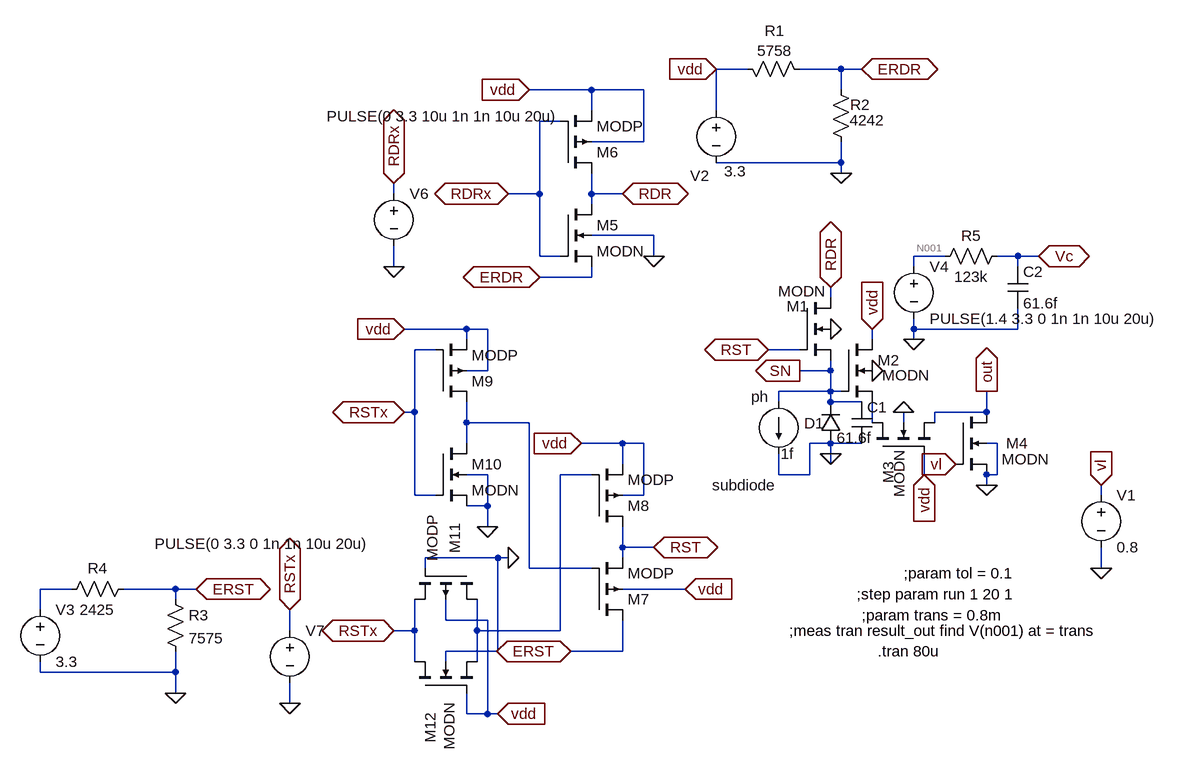
[diagram p0: schematic LIN LOG 2014 completo.asc]
LIN LOG 2014 completo.asc, the LTspice schematic file:
Version 4
SHEET 1 1672 840
WIRE 288 -4096 240 -4096
WIRE 432 -4096 368 -4096
WIRE 464 -4096 432 -4096
WIRE 48 -4064 -48 -4064
WIRE 128 -4064 48 -4064
WIRE 432 -4064 432 -4096
WIRE 48 -4032 48 -4064
WIRE 240 -4032 240 -4096
WIRE 0 -4016 -32 -4016
WIRE 128 -3984 128 -4064
WIRE 128 -3984 48 -3984
WIRE 432 -3952 432 -3984
WIRE 432 -3952 240 -3952
WIRE 432 -3936 432 -3952
WIRE -256 -3904 -256 -3920
WIRE -32 -3904 -32 -4016
WIRE -32 -3904 -80 -3904
WIRE 48 -3904 48 -3936
WIRE 96 -3904 48 -3904
WIRE 48 -3888 48 -3904
WIRE 144 -3840 48 -3840
WIRE -32 -3808 -32 -3904
WIRE 0 -3808 -32 -3808
WIRE 144 -3808 144 -3840
WIRE 592 -3808 544 -3808
WIRE 704 -3808 672 -3808
WIRE 736 -3808 704 -3808
WIRE -256 -3792 -256 -3824
WIRE 544 -3792 544 -3808
WIRE 704 -3792 704 -3808
WIRE 48 -3776 48 -3792
WIRE 48 -3776 -32 -3776
WIRE 416 -3744 416 -3760
WIRE -144 -3696 -240 -3696
WIRE -112 -3696 -144 -3696
WIRE 544 -3696 544 -3712
WIRE 704 -3696 704 -3728
WIRE 704 -3696 544 -3696
WIRE -144 -3680 -144 -3696
WIRE 480 -3680 480 -3696
WIRE 544 -3680 544 -3696
WIRE -192 -3664 -224 -3664
WIRE 368 -3664 320 -3664
WIRE -112 -3632 -112 -3696
WIRE -112 -3632 -144 -3632
WIRE 416 -3632 416 -3648
WIRE 416 -3632 368 -3632
WIRE 416 -3600 416 -3632
WIRE 416 -3600 336 -3600
WIRE 432 -3600 416 -3600
WIRE 336 -3584 336 -3600
WIRE 416 -3584 416 -3600
WIRE 464 -3584 416 -3584
WIRE -224 -3568 -224 -3664
WIRE -224 -3568 -240 -3568
WIRE 656 -3568 656 -3600
WIRE 656 -3568 576 -3568
WIRE -144 -3552 -144 -3584
WIRE -48 -3552 -144 -3552
WIRE 480 -3552 480 -3584
WIRE 528 -3552 528 -3568
WIRE 576 -3552 576 -3568
WIRE -144 -3520 -144 -3552
WIRE 96 -3520 32 -3520
WIRE 128 -3520 96 -3520
WIRE 416 -3520 384 -3520
WIRE 464 -3520 416 -3520
WIRE 672 -3520 656 -3520
WIRE 416 -3504 416 -3520
WIRE 96 -3488 96 -3520
WIRE 416 -3488 416 -3504
WIRE -112 -3472 -144 -3472
WIRE 48 -3472 0 -3472
WIRE 336 -3472 336 -3504
WIRE 384 -3472 384 -3520
WIRE 384 -3472 336 -3472
WIRE 560 -3472 560 -3504
WIRE 656 -3472 656 -3488
WIRE 672 -3472 672 -3520
WIRE 672 -3472 656 -3472
WIRE 656 -3456 656 -3472
WIRE -224 -3440 -224 -3568
WIRE -192 -3440 -224 -3440
WIRE 128 -3440 128 -3520
WIRE 128 -3440 96 -3440
WIRE 832 -3440 832 -3456
WIRE -112 -3424 -112 -3472
WIRE -112 -3424 -144 -3424
WIRE -112 -3392 -112 -3424
WIRE 96 -3360 96 -3392
WIRE 144 -3360 96 -3360
WIRE -96 -3344 -208 -3344
WIRE -80 -3344 -96 -3344
WIRE 96 -3344 96 -3360
WIRE -208 -3328 -208 -3344
WIRE -48 -3328 -48 -3552
WIRE 48 -3328 -48 -3328
WIRE 832 -3328 832 -3360
WIRE -752 -3296 -800 -3296
WIRE -592 -3296 -672 -3296
WIRE -560 -3296 -592 -3296
WIRE 192 -3296 96 -3296
WIRE -592 -3280 -592 -3296
WIRE -800 -3264 -800 -3296
WIRE -176 -3248 -176 -3280
WIRE -112 -3248 -176 -3248
WIRE -416 -3232 -416 -3264
WIRE -224 -3232 -224 -3280
WIRE -224 -3232 -256 -3232
WIRE -128 -3232 -128 -3280
WIRE 0 -3232 0 -3472
WIRE 0 -3232 -128 -3232
WIRE -96 -3200 -96 -3344
WIRE -96 -3200 -176 -3200
WIRE 96 -3200 96 -3248
WIRE 96 -3200 16 -3200
WIRE -224 -3184 -224 -3232
WIRE -176 -3184 -176 -3200
WIRE -128 -3184 -128 -3232
WIRE -800 -3168 -800 -3184
WIRE -592 -3168 -592 -3200
WIRE -592 -3168 -800 -3168
WIRE -592 -3136 -592 -3168
WIRE -416 -3120 -416 -3152
WIRE -144 -3104 -144 -3136
WIRE -112 -3104 -112 -3248
WIRE -112 -3104 -144 -3104
WIRE -96 -3104 -112 -3104
FLAG 320 -3664 RST
IOPIN 320 -3664 BiDir
FLAG 832 -3328 0
FLAG 432 -3936 0
FLAG 416 -3696 0
FLAG 416 -3504 0
FLAG 416 -3760 RDR
IOPIN 416 -3760 BiDir
FLAG 240 -4096 vdd
IOPIN 240 -4096 In
FLAG 480 -3632 0
FLAG 656 -3456 0
FLAG 608 -3488 vl
IOPIN 608 -3488 In
FLAG 832 -3456 vl
IOPIN 832 -3456 In
FLAG 480 -3696 vdd
IOPIN 480 -3696 In
FLAG 528 -3568 0
FLAG 560 -3472 vdd
IOPIN 560 -3472 In
FLAG 656 -3600 out
IOPIN 656 -3600 Out
FLAG 368 -3632 SN
IOPIN 368 -3632 Out
FLAG 464 -4096 ERDR
IOPIN 464 -4096 BiDir
FLAG -48 -4064 vdd
IOPIN -48 -4064 In
FLAG 144 -3808 0
FLAG 96 -3904 RDR
IOPIN 96 -3904 BiDir
FLAG -80 -3904 RDRx
IOPIN -80 -3904 BiDir
FLAG -32 -3776 ERDR
IOPIN -32 -3776 BiDir
FLAG -256 -3792 0
FLAG -256 -3920 RDRx
IOPIN -256 -3920 BiDir
FLAG 32 -3520 vdd
IOPIN 32 -3520 In
FLAG 144 -3360 RST
IOPIN 144 -3360 BiDir
FLAG 192 -3296 vdd
IOPIN 192 -3296 In
FLAG 16 -3200 ERST
IOPIN 16 -3200 BiDir
FLAG -240 -3696 vdd
IOPIN -240 -3696 In
FLAG -240 -3568 RSTx
IOPIN -240 -3568 BiDir
FLAG -112 -3392 0
FLAG -96 -3104 vdd
IOPIN -96 -3104 In
FLAG -80 -3344 0
FLAG -256 -3232 RSTx
IOPIN -256 -3232 BiDir
FLAG -416 -3264 RSTx
IOPIN -416 -3264 BiDir
FLAG -416 -3120 0
FLAG -592 -3136 0
FLAG -560 -3296 ERST
IOPIN -560 -3296 BiDir
FLAG 736 -3808 Vc
IOPIN 736 -3808 BiDir
FLAG 544 -3680 0
SYMBOL voltage 832 -3456 R0
WINDOW 123 0 0 Left 2
WINDOW 39 0 0 Left 2
SYMATTR InstName V1
SYMATTR Value 0.8
SYMBOL voltage 240 -4048 R0
WINDOW 123 0 0 Left 2
WINDOW 39 0 0 Left 2
WINDOW 0 -40 116 Left 2
WINDOW 3 12 109 Left 2
SYMATTR InstName V2
SYMATTR Value 3.3
SYMBOL nmos4 368 -3744 R0
WINDOW 0 -20 13 Left 2
WINDOW 3 -33 -10 Left 2
SYMATTR InstName M1
SYMATTR Value MODN
SYMATTR Value2 l=0.35u w=0.7u
SYMBOL nmos4 432 -3680 R0
WINDOW 3 63 55 Left 2
SYMATTR Value MODN
SYMATTR InstName M2
SYMBOL nmos4 608 -3568 R0
WINDOW 0 78 48 Left 2
WINDOW 3 71 72 Left 2
SYMATTR InstName M4
SYMATTR Value MODN
SYMBOL diode 432 -3520 R180
WINDOW 0 26 31 Left 2
WINDOW 3 100 -64 Left 2
SYMATTR InstName D1
SYMATTR Value subdiode
SYMBOL current 336 -3584 R0
WINDOW 3 3 80 Left 2
WINDOW 123 0 0 Left 2
WINDOW 39 0 0 Left 2
WINDOW 0 -42 -8 Left 2
SYMATTR Value 1f
SYMATTR InstName ph
SYMBOL nmos4 480 -3504 R270
WINDOW 0 -46 25 Left 2
WINDOW 3 -67 42 Left 2
SYMATTR InstName M3
SYMATTR Value MODN
SYMBOL res 272 -4112 M90
WINDOW 0 -27 58 VBottom 2
WINDOW 3 -28 58 VTop 2
SYMATTR InstName R1
SYMATTR Value 5758
SYMBOL res 448 -3968 R180
WINDOW 0 -29 73 Left 2
WINDOW 3 -51 49 Left 2
SYMATTR InstName R2
SYMATTR Value 4242
SYMBOL nmos4 0 -3888 R0
SYMATTR InstName M5
SYMATTR Value MODN
SYMBOL pmos4 0 -3936 M180
SYMATTR InstName M6
SYMATTR Value MODP
SYMBOL voltage -256 -3920 R0
WINDOW 3 -103 -103 Left 2
WINDOW 123 0 0 Left 2
WINDOW 39 0 0 Left 2
SYMATTR Value PULSE(0 3.3 10u 1n 1n 10u 20u)
SYMATTR InstName V6
SYMBOL pmos4 48 -3248 M180
SYMATTR InstName M7
SYMATTR Value MODP
SYMBOL pmos4 48 -3392 M180
SYMATTR InstName M8
SYMATTR Value MODP
SYMBOL pmos4 -192 -3584 M180
SYMATTR InstName M9
SYMATTR Value MODP
SYMBOL nmos4 -192 -3520 R0
SYMATTR InstName M10
SYMATTR Value MODN
SYMBOL pmos4 -128 -3328 R90
WINDOW 0 -70 34 Left 2
WINDOW 3 -82 69 Left 2
SYMATTR InstName M11
SYMATTR Value MODP
SYMBOL nmos4 -224 -3136 R270
WINDOW 0 -77 24 Left 2
WINDOW 3 -88 53 Left 2
SYMATTR InstName M12
SYMATTR Value MODN
SYMBOL voltage -416 -3248 R0
WINDOW 3 -208 -118 Left 2
WINDOW 123 0 0 Left 2
WINDOW 39 0 0 Left 2
SYMATTR Value PULSE(0 3.3 0 1n 1n 10u 20u)
SYMATTR InstName V7
SYMBOL res -608 -3296 R0
SYMATTR InstName R3
SYMATTR Value 7575
SYMBOL res -656 -3312 R90
WINDOW 0 0 56 VBottom 2
WINDOW 3 32 56 VTop 2
SYMATTR InstName R4
SYMATTR Value 2425
SYMBOL voltage -800 -3280 R0
SYMATTR InstName V3
SYMATTR Value 3.3
SYMBOL cap 448 -3584 R0
WINDOW 3 -23 55 Left 2
SYMATTR Value 61.6f
SYMATTR InstName C1
SYMBOL res 688 -3824 R90
WINDOW 0 0 56 VBottom 2
WINDOW 3 32 56 VTop 2
SYMATTR InstName R5
SYMATTR Value 123k
SYMBOL cap 688 -3792 R0
SYMATTR InstName C2
SYMATTR Value 61.6f
SYMBOL voltage 544 -3808 R0
WINDOW 123 0 0 Left 2
WINDOW 39 0 0 Left 2
SYMATTR InstName V4
SYMATTR Value PULSE(1.4 3.3 0 1n 1n 10u 20u)
TEXT 488 -3200 Left 2 !.tran 80u
TEXT 528 -3320 Left 2 !;param tol = 0.1
TEXT 456 -3288 Left 2 !;step param run 1 20 1
TEXT 464 -3256 Left 2 !;param trans = 0.8m
TEXT 352 -3232 Left 2 !;meas tran result_out find V(n001) at = trans

The netlist it stands for:
* LIN LOG 2014 completo.asc
V1 vl 0 0.8
V2 vdd 0 3.3
M1 RDR RST SN 0 MODN l=0.35u w=0.7u
M2 vdd SN N003 0 MODN
M4 out vl 0 0 MODN
D1 0 SN subdiode
I§ph SN 0 1f
M3 N003 vdd out 0 MODN
R1 vdd ERDR 5758
R2 0 ERDR 4242
M5 RDR RDRx ERDR 0 MODN
M6 RDR RDRx vdd vdd MODP
V6 RDRx 0 PULSE(0 3.3 10u 1n 1n 10u 20u)
M7 ERST N002 RST vdd MODP
M8 RST N004 vdd vdd MODP
M9 N002 RSTx vdd vdd MODP
M10 N002 RSTx 0 0 MODN
M11 N004 0 RSTx vdd MODP
M12 RSTx vdd N004 0 MODN
V7 RSTx 0 PULSE(0 3.3 0 1n 1n 10u 20u)
R3 ERST 0 7575
R4 ERST N005 2425
V3 N005 0 3.3
C1 SN 0 61.6f
R5 Vc N001 123k
C2 Vc 0 61.6f
V4 N001 0 PULSE(1.4 3.3 0 1n 1n 10u 20u)
.model D D
.lib standard.dio
.model NMOS NMOS
.model PMOS PMOS
.lib standard.mos
.tran 80u
;param tol = 0.1
;step param run 1 20 1
;param trans = 0.8m
;meas tran result_out find V(n001) at = trans
.backanno
.end